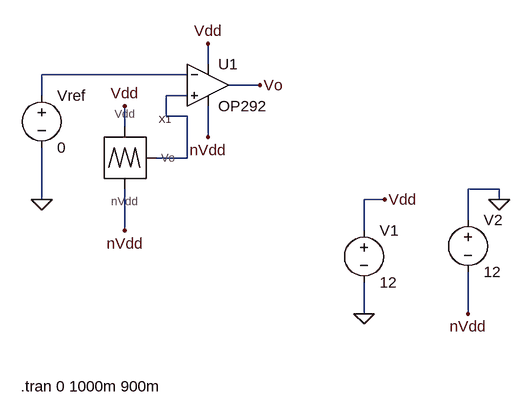
[diagram p0: schematic PWMGenerator_withcomparator.asc]
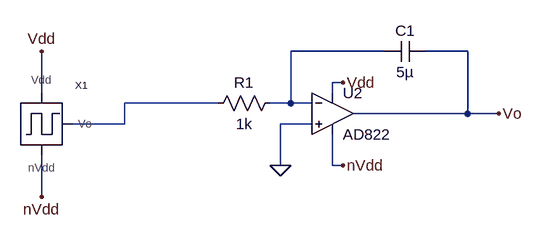
[diagram p1: sub-circuit trianglewavegenerator.asc]
PWMGenerator_withcomparator.asc, the LTspice schematic file:
Version 4
SHEET 1 880 680
WIRE 128 96 128 64
WIRE 96 112 -128 112
WIRE 208 128 160 128
WIRE -128 144 -128 112
WIRE 96 144 64 144
WIRE 64 176 64 144
WIRE 96 176 64 176
WIRE 0 192 0 160
WIRE 128 208 128 160
WIRE 96 240 96 176
WIRE 96 240 48 240
WIRE 576 288 528 288
WIRE -128 304 -128 224
WIRE 400 304 368 304
WIRE 576 304 576 288
WIRE 528 336 528 288
WIRE 0 352 0 288
WIRE 368 352 368 304
WIRE 368 480 368 432
WIRE 528 480 528 416
FLAG -128 304 0
FLAG 368 480 0
FLAG 576 304 0
FLAG 400 304 Vdd
FLAG 528 480 nVdd
FLAG 0 352 nVdd
FLAG 128 208 nVdd
FLAG 128 64 Vdd
FLAG 0 160 Vdd
FLAG 208 128 Vo
SYMBOL OpAmps\\OP292 128 64 R0
SYMATTR InstName U1
SYMBOL voltage -128 128 R0
WINDOW 123 0 0 Left 0
WINDOW 39 0 0 Left 0
SYMATTR InstName Vref
SYMATTR Value 0
SYMBOL trianglewavegenerator 0 240 R0
SYMATTR InstName X1
SYMBOL voltage 368 336 R0
SYMATTR InstName V1
SYMATTR Value 12
SYMBOL voltage 528 320 R0
SYMATTR InstName V2
SYMATTR Value 12
TEXT -160 592 Left 2 !.tran 0 1000m 900m

trianglewavegenerator.asc, the sub-circuit schematic file:
Version 4
SHEET 1 1252 680
WIRE 704 48 560 48
WIRE 832 48 768 48
WIRE 640 96 624 96
WIRE 176 112 176 48
WIRE 624 112 624 96
WIRE 448 128 304 128
WIRE 560 128 560 48
WIRE 560 128 528 128
WIRE 592 128 560 128
WIRE 832 144 832 48
WIRE 832 144 656 144
WIRE 880 144 832 144
WIRE 304 160 304 128
WIRE 304 160 224 160
WIRE 592 160 544 160
WIRE 544 224 544 160
WIRE 624 224 624 176
WIRE 640 224 624 224
WIRE 176 272 176 208
FLAG 176 48 Vdd
FLAG 176 272 nVdd
FLAG 544 224 0
FLAG 640 224 nVdd
FLAG 640 96 Vdd
FLAG 880 144 Vo
SYMBOL squarewavegenerator 176 160 R0
SYMATTR InstName X1
SYMBOL res 544 112 R90
WINDOW 0 0 56 VBottom 2
WINDOW 3 32 56 VTop 2
SYMATTR InstName R1
SYMATTR Value 1k
SYMBOL cap 768 32 R90
WINDOW 0 0 32 VBottom 2
WINDOW 3 32 32 VTop 2
SYMATTR InstName C1
SYMATTR Value 5µ
SYMBOL OpAmps\\AD822 624 80 R0
SYMATTR InstName U2

The netlist it stands for:
* PWMGenerator_withcomparator.asc
XU1 N002 N001 Vdd nVdd Vo OP292  ; pins In+ In- V+ V- OUT
Vref N001 0 0
XX1 N002 Vdd nVdd trianglewavegenerator
V1 Vdd 0 12
V2 0 nVdd 12

* block symbol definitions
.subckt trianglewavegenerator Vo Vdd nVdd
XX1 Vdd nVdd N002 squarewavegenerator  ; pins Vdd nVdd Vo
R1 N001 N002 1k
C1 Vo N001 5µ
XU2 0 N001 Vdd nVdd Vo AD822  ; pins In+ In- V+ V- OUT
.ends trianglewavegenerator

.tran 0 1000m 900m
.lib ADI1.lib
.backanno
.end